# EAGLE design frame_LNA (EAGLE 9.6.2)
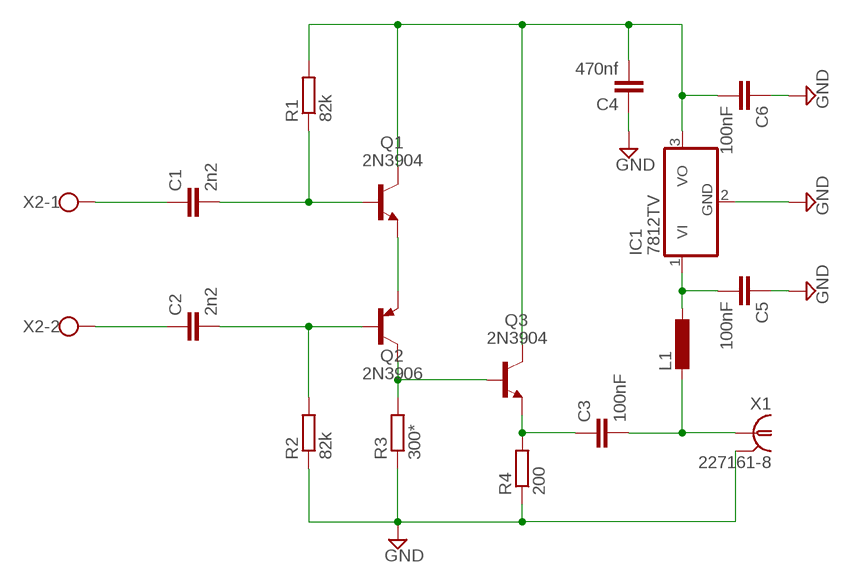
[diagram p0: schematic, sheet 1]

## Parts
C1  2n2  C-EUC0805K  [C0805K]
C2  2n2  C-EUC0805K  [C0805K]
C3  100nF  C-EUC0805K  [C0805K]
C4  470nf  C-EUC0805K  [C0805K]
C5  100nF  C-EUC0805K  [C0805K]
C6  100nF  C-EUC0805K  [C0805K]
IC1  7812TV  [TO220V]
L1  L-EU0207/12  [0207/12]
Q1  2N3904  [TO92]
Q2  2N3906  [TO92]
Q3  2N3904  [TO92]
R1  82k  R-EU_R0805  [R0805]
R2  82k  R-EU_R0805  [R0805]
R3  300*  R-EU_R0805  [R0805]
R4  200  R-EU_R0805  [R0805]
X1  227161-8  [AMP_227161]
X2  W237-102  [W237-102]

## Nets
GND: C4.1 C5.1 C6.1 IC1.2(GND) R2.1 R3.1 R4.1 X1.2
N$1: Q1.3(E) Q2.3(E)
N$2: C1.2 Q1.2(B) R1.1
N$3: C2.2 Q2.2(B) R2.2
N$4: C4.2 C6.2 IC1.3(VO) Q1.1(C) Q3.1(C) R1.2
N$5: Q2.1(C) Q3.2(B) R3.2
N$6: C3.1 Q3.3(E) R4.2
N$7: C3.2 L1.2 X1.1
N$8: C1.1 X2.1
N$9: C2.1 X2.2
N$10: C5.2 IC1.1(VI) L1.1

## Library data of the parts
C1-C6 = rcl:C-EU: CAPACITOR, European symbol; SPICEPREFIX: C
IC1 = linear:78*: Positive VOLTAGE REGULATOR Source: http://cache.national.com/ds/LM/LM78L05.pdf http://www.fairchildsemi.com/ds/LM/LM7805.pdf
L1 = rcl:L-EU: INDUCTOR, European symbol; SPICEPREFIX: L
Q1 Q3 = transistor-npn:2N3904: NPN Transistor
Q2 = transistor-pnp:2N3906: PNP Transistor
R1-R4 = rcl:R-EU_: RESISTOR, European symbol; SPICEPREFIX: R
X1 = con-coax:?227161*: JACK, RIGHT ANGLE, 50 OHM, PCB, BNC Source: amp_227161.pdf; OC_FARNELL: unknown; OC_NEWARK: unknown
X2 = con-wago-500:W237-102: WAGO SCREW CLAMP; MPN: 237-102; OC_FARNELL: unknown; OC_NEWARK: 70K9898

## Board
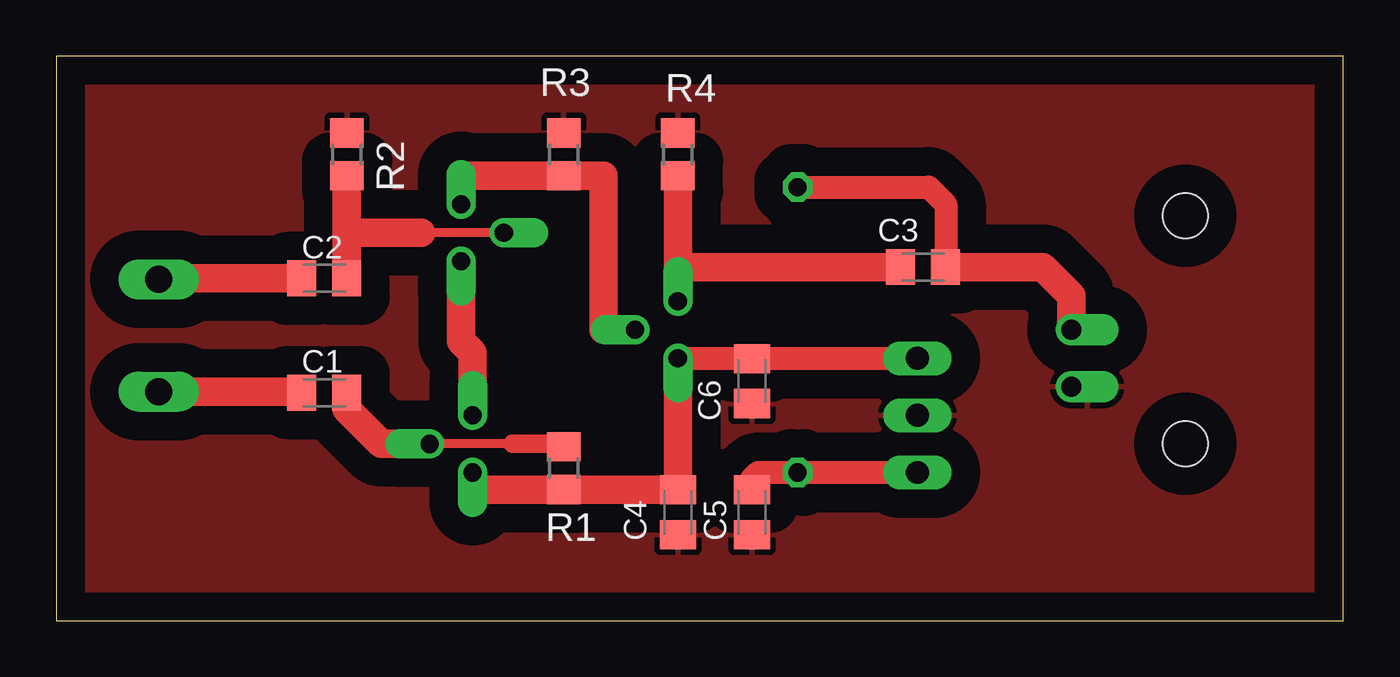
[diagram p1: board, top side]
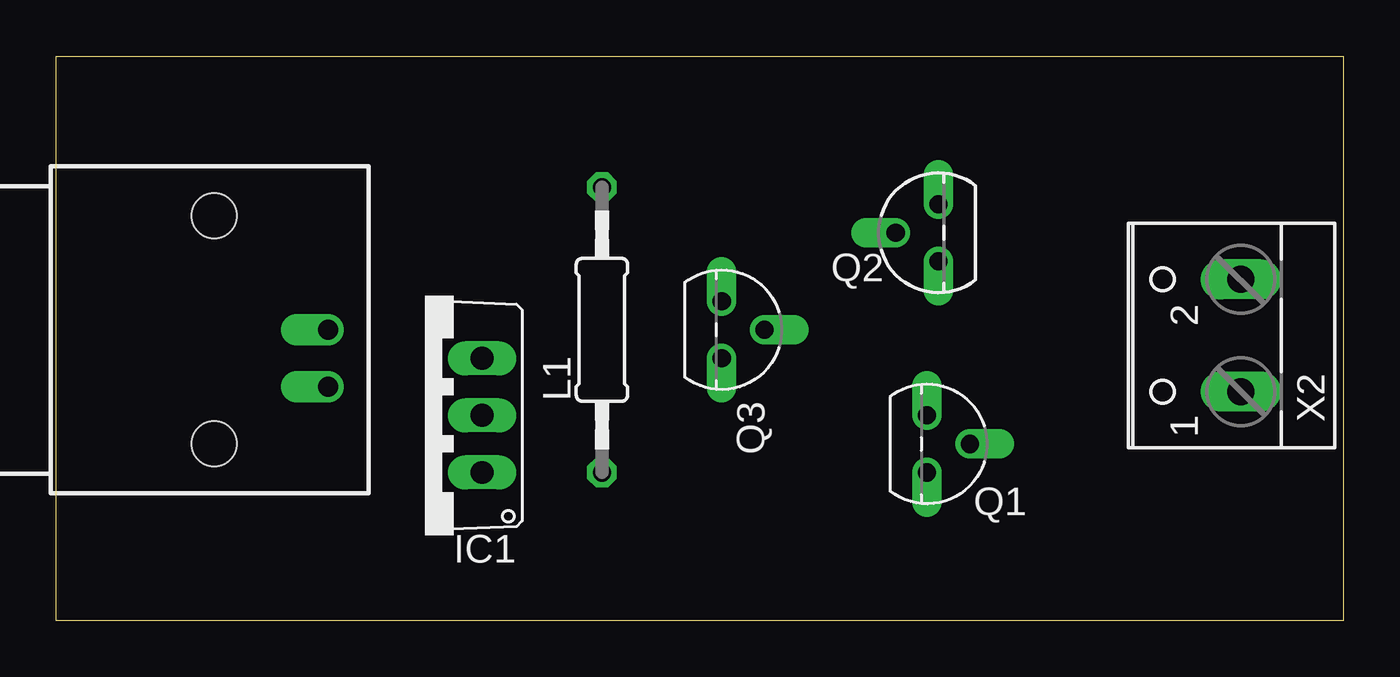
[diagram p2: board, bottom side, seen from below]

Size 57.33 x 25.14 mm. Coordinates in mm from the lower left corner, seen from the top.
Outline: 0,0 57.33,0 57.33,25.14 0,25.14 0,0
Copper layers (1*16): Top 0.035mm / dielectric 1.5mm / Bottom 0.035mm
Design rules "default": minimum track width 6mil, minimum drill 0.35mm, track to track 6mil, track to pad 6mil, pad to pad 6mil, via to via 6mil, smd to smd 6mil, copper to edge 40mil, drill to drill 6mil, minimum pad ring 10mil, minimum via ring 8mil, stop-mask expansion 4mil, vias tented up to drill 0mil, thermal gap 10mil

### Footprints (pad centres in the part's own frame; a part is rotated, then mirrored left to right if it is on the bottom)
C0805K = smd 1.3 x 1.6: 1 -1,0; 2 1,0
TO220V = drill 1.016 long: 1 -2.54,-2.54; 2 0,-2.54; 3 2.54,-2.54
0207/12 = drill 0.813 octagon: 1 -6.35,0; 2 6.35,0
TO92 = drill 0.813 offset: 1 1.27,0; 2 0,1.905; 3 -1.27,0
R0805 = smd 1.3 x 1.5: 1 -0.95,0; 2 0.95,0
AMP_227161 = drill 0.9 pad 1.27 offset: 1 0,-5.08; 2 -2.54,-5.08 | hole 2: -5.08,0; 5.08,0
W237-102 = drill 1.194 long: 1 -2.5,-1.27; 2 2.5,-1.27

### Placement (x,y rotation side)
C1  11.94,10.16 0 top
C2  11.94,15.24 0 top
C3  38.61,15.75 0 top
C4  27.69,4.83 90 top
C5  30.99,4.83 90 top
C6  30.99,10.67 90 top
IC1  40.89,9.14 90 bottom
L1  33.02,12.95 90 bottom
Q1  18.54,7.87 270 bottom
Q2  18.03,17.27 90 bottom
Q3  27.69,12.95 270 bottom
R1  22.61,6.79 270 top
R2  12.95,20.76 270 top
R3  22.61,20.76 270 top
R4  27.69,20.76 270 top
X1  50.29,12.95 90 bottom
X2  5.84,12.7 90 bottom

### Tracks (layer width: path | path; a pad name or v marks a point on that pad's centre or on a via)
GND
  pour Top (isolate 1.27): 58.67,-1.52 -1.27,-1.52 -1.27,26.42 58.67,26.42
N$1
  Top 1.27: Q1.3 18.54,11.94 18.03,12.45 Q2.3
N$2
  Top 0.406: 20.32,7.87 Q1.2
  Top 0.813: 20.32,7.87 22.47,7.87 R1.1
  Top 1.27: Q1.2 14.48,7.87 12.94,9.41 C1.2
N$3
  Top 0.406: Q2.2 16.26,17.27
  Top 1.27: C2.2 12.94,17.27 | 12.94,17.27 12.94,19.8 R2.2 | 16.26,17.27 12.94,17.27
N$4
  Top 1.016: Q3.1 30.97,11.68 C6.2 31,11.68 IC1.3
  Top 1.27: Q1.1 18.54,6.1 18.8,5.84 R1.2 27.67,5.84 C4.2 Q3.1
N$5
  Top 1.27: Q2.1 18.03,19.56 18.29,19.81 R3.2 24.38,19.81 24.38,12.95 Q3.2
N$6
  Top 1.27: R4.2 27.69,15.75 | 27.69,15.75 Q3.3 | C3.1 27.69,15.75
N$7
  Top 1.016: L1.2 38.86,19.3 39.62,18.54 39.62,15.76 C3.2
  Top 1.27: X1.1 45.21,14.48 43.94,15.75 C3.2
N$8
  Top 1.27: X2.1 10.9,10.2 C1.1
N$9
  Top 1.27: X2.2 4.61,15.24 C2.1
N$10
  Top 1.016: C5.2 30.99,6.33 31.26,6.6 L1.1 IC1.1